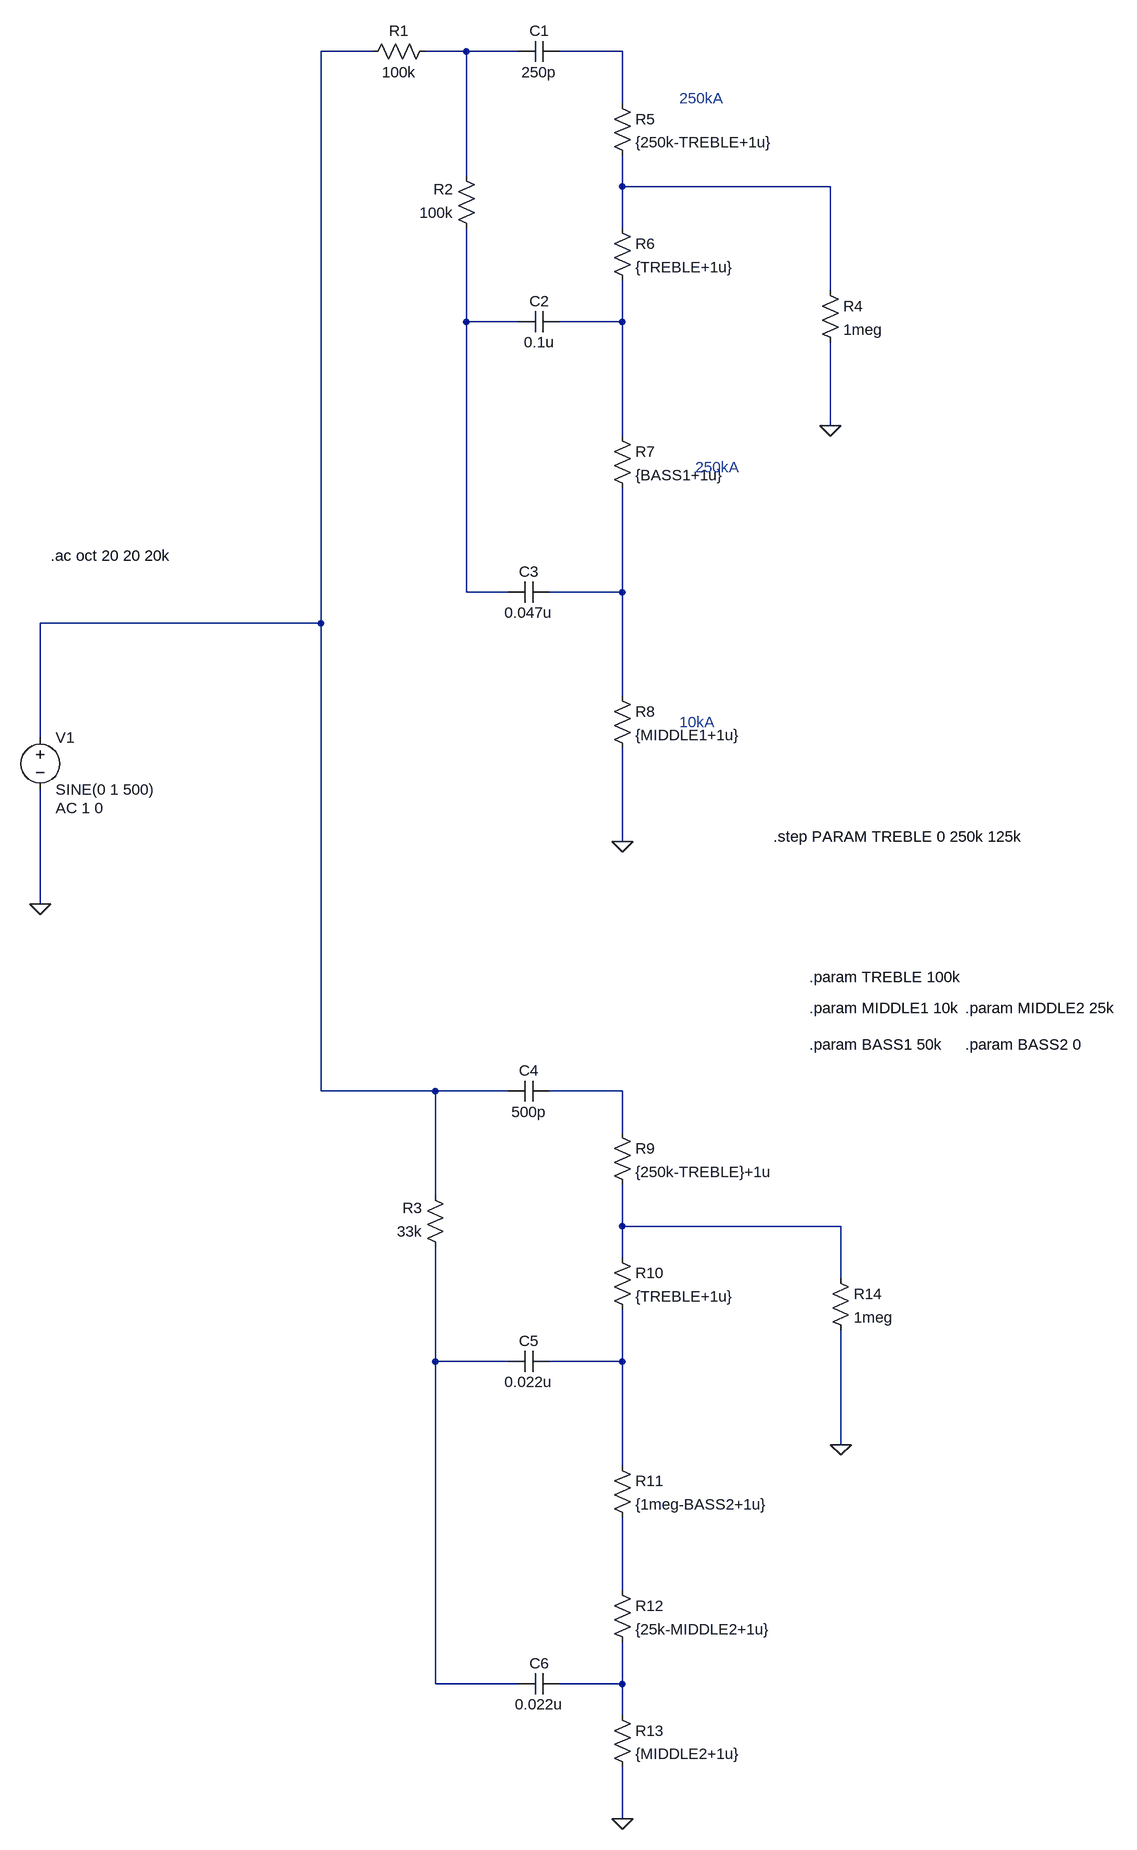
[diagram p0: schematic Guitar Amp Tone.asc]
Guitar Amp Tone.asc, the LTspice schematic file:
Version 4
SHEET 1 880 2708
WIRE -1152 -928 -1232 -928
WIRE -1008 -928 -1072 -928
WIRE -928 -928 -1008 -928
WIRE -768 -928 -864 -928
WIRE -768 -848 -768 -928
WIRE -1008 -736 -1008 -928
WIRE -768 -720 -768 -768
WIRE -448 -720 -768 -720
WIRE -768 -656 -768 -720
WIRE -448 -560 -448 -720
WIRE -1008 -512 -1008 -656
WIRE -928 -512 -1008 -512
WIRE -768 -512 -768 -576
WIRE -768 -512 -864 -512
WIRE -448 -352 -448 -480
WIRE -768 -336 -768 -512
WIRE -1008 -96 -1008 -512
WIRE -944 -96 -1008 -96
WIRE -768 -96 -768 -256
WIRE -768 -96 -880 -96
WIRE -1232 -48 -1232 -928
WIRE -1232 -48 -1664 -48
WIRE -768 64 -768 -96
WIRE -1664 128 -1664 -48
WIRE -768 288 -768 144
WIRE -1664 384 -1664 208
WIRE -1232 672 -1232 -48
WIRE -1056 672 -1232 672
WIRE -944 672 -1056 672
WIRE -768 672 -880 672
WIRE -768 736 -768 672
WIRE -1056 832 -1056 672
WIRE -768 880 -768 816
WIRE -432 880 -768 880
WIRE -768 928 -768 880
WIRE -432 960 -432 880
WIRE -1056 1088 -1056 912
WIRE -944 1088 -1056 1088
WIRE -768 1088 -768 1008
WIRE -768 1088 -880 1088
WIRE -432 1216 -432 1040
WIRE -768 1248 -768 1088
WIRE -768 1440 -768 1328
WIRE -1056 1584 -1056 1088
WIRE -928 1584 -1056 1584
WIRE -768 1584 -768 1520
WIRE -768 1584 -864 1584
WIRE -768 1632 -768 1584
WIRE -768 1792 -768 1712
FLAG -768 288 0
FLAG -768 1792 0
FLAG -1664 384 0
FLAG -448 -352 0
FLAG -432 1216 0
SYMBOL res -1056 -944 R90
WINDOW 0 0 56 VBottom 2
WINDOW 3 32 56 VTop 2
SYMATTR InstName R1
SYMATTR Value 100k
SYMBOL res -992 -640 R180
WINDOW 0 36 76 Left 2
WINDOW 3 36 40 Left 2
SYMATTR InstName R2
SYMATTR Value 100k
SYMBOL res -1040 928 R180
WINDOW 0 36 76 Left 2
WINDOW 3 36 40 Left 2
SYMATTR InstName R3
SYMATTR Value 33k
SYMBOL res -464 -576 R0
SYMATTR InstName R4
SYMATTR Value 1meg
SYMBOL res -784 -864 R0
SYMATTR InstName R5
SYMATTR Value {250k-TREBLE+1u}
SYMBOL res -784 -672 R0
SYMATTR InstName R6
SYMATTR Value {TREBLE+1u}
SYMBOL res -784 -352 R0
SYMATTR InstName R7
SYMATTR Value {BASS1+1u}
SYMBOL res -784 48 R0
SYMATTR InstName R8
SYMATTR Value {MIDDLE1+1u}
SYMBOL res -784 720 R0
SYMATTR InstName R9
SYMATTR Value {250k-TREBLE}+1u
SYMBOL res -784 912 R0
SYMATTR InstName R10
SYMATTR Value {TREBLE+1u}
SYMBOL res -784 1232 R0
SYMATTR InstName R11
SYMATTR Value {1meg-BASS2+1u}
SYMBOL res -784 1424 R0
SYMATTR InstName R12
SYMATTR Value {25k-MIDDLE2+1u}
SYMBOL res -784 1616 R0
SYMATTR InstName R13
SYMATTR Value {MIDDLE2+1u}
SYMBOL res -448 944 R0
SYMATTR InstName R14
SYMATTR Value 1meg
SYMBOL voltage -1664 112 R0
WINDOW 123 24 124 Left 2
WINDOW 39 0 0 Left 2
SYMATTR Value2 AC 1 0
SYMATTR InstName V1
SYMATTR Value SINE(0 1 500)
SYMBOL cap -864 -944 R90
WINDOW 0 0 32 VBottom 2
WINDOW 3 32 32 VTop 2
SYMATTR InstName C1
SYMATTR Value 250p
SYMBOL cap -864 -528 R90
WINDOW 0 0 32 VBottom 2
WINDOW 3 32 32 VTop 2
SYMATTR InstName C2
SYMATTR Value 0.1u
SYMBOL cap -880 -112 R90
WINDOW 0 0 32 VBottom 2
WINDOW 3 32 32 VTop 2
SYMATTR InstName C3
SYMATTR Value 0.047u
SYMBOL cap -880 656 R90
WINDOW 0 0 32 VBottom 2
WINDOW 3 32 32 VTop 2
SYMATTR InstName C4
SYMATTR Value 500p
SYMBOL cap -880 1072 R90
WINDOW 0 0 32 VBottom 2
WINDOW 3 32 32 VTop 2
SYMATTR InstName C5
SYMATTR Value 0.022u
SYMBOL cap -864 1568 R90
WINDOW 0 0 32 VBottom 2
WINDOW 3 32 32 VTop 2
SYMATTR InstName C6
SYMATTR Value 0.022u
TEXT -480 496 Left 2 !.param TREBLE 100k
TEXT -240 544 Left 2 !.param MIDDLE2 25k
TEXT -240 600 Left 2 !.param BASS2 0
TEXT -1648 -152 Left 2 !.ac oct 20 20 20k
TEXT -680 -856 Left 2 ;250kA
TEXT -656 -288 Left 2 ;250kA
TEXT -680 104 Left 2 ;10kA
TEXT -480 544 Left 2 !.param MIDDLE1 10k
TEXT -480 600 Left 2 !.param BASS1 50k
TEXT -536 280 Left 2 !.step PARAM TREBLE 0 250k 125k

The netlist it stands for:
* Guitar Amp Tone.asc
R1 N002 N001 100k
R2 N005 N002 100k
R3 N010 N001 33k
R4 N004 0 1meg
R5 N003 N004 {250k-TREBLE+1u}
R6 N004 N006 {TREBLE+1u}
R7 N006 N007 {BASS1+1u}
R8 N007 0 {MIDDLE1+1u}
R9 N008 N009 {250k-TREBLE}+1u
R10 N009 N011 {TREBLE+1u}
R11 N011 N012 {1meg-BASS2+1u}
R12 N012 N013 {25k-MIDDLE2+1u}
R13 N013 0 {MIDDLE2+1u}
R14 N009 0 1meg
V1 N001 0 SINE(0 1 500) AC 1 0
C1 N003 N002 250p
C2 N006 N005 0.1u
C3 N007 N005 0.047u
C4 N008 N001 500p
C5 N011 N010 0.022u
C6 N013 N010 0.022u
.param TREBLE 100k
.param MIDDLE2 25k
.param BASS2 0
.ac oct 20 20 20k
* 250kA
* 250kA
* 10kA
.param MIDDLE1 10k
.param BASS1 50k
.step PARAM TREBLE 0 250k 125k
.backanno
.end